# EAGLE design Sketch_1 (EAGLE 9.4.2)
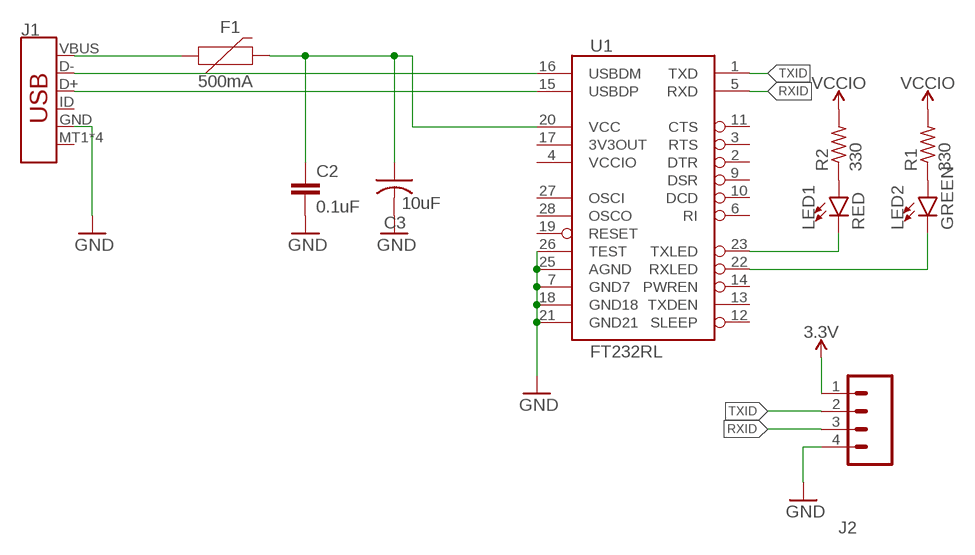
[diagram p0: schematic, sheet 1]

## Parts
C2  0.1uF  C-EUC1206K  [C1206K]
C3  10uF  C-USC1206K  [C1206K]
F1  500mA  PPTC_6V500MA  [0805]
J1  USB_MICRO-B_SMT  [USB-MICROB]
J2  M04  [04P]
LED1  RED  LED-RED1206  [LED-1206]
LED2  GREEN  LED-GREEN1206  [LED-1206]
R1  330  R-US_R1206  [R1206]
R2  330  R-US_R1206  [R1206]
U1  FT232RL  FT232RLSSOP  [SSOP28DB]

## Nets
GND: C2.2 C3.2 J1.GND J2.4 U1.7(GND7) U1.18(GND18) U1.21(GND21) U1.25(AGND) U1.26(TEST)
N$1: F1.1 J1.VBUS
N$2: C2.1 C3.1 F1.2 U1.20(VCC)
N$3: J1.D- U1.16(USBDM)
N$4: J1.D+ U1.15(USBDP)
N$5: LED2.A R1.1
N$6: LED1.A R2.1
N$7: LED1.C U1.23(TXLED)
N$8: LED2.C U1.22(RXLED)
RXID: J2.3 U1.5(RXD)
TXID: J2.2 U1.1(TXD)
VCC: J2.1 ; supply symbol labelled 3.3V
VCCIO: R1.2 R2.2
Unconnected: J1.ID J1.MT1(SHIELD) J1.MT2(SHIELD) J1.P$1(SHIELD) J1.P$2(SHIELD) U1.2(DTR) U1.3(RTS) U1.6(RI) U1.9(DSR) U1.10(DCD) U1.11(CTS) U1.12(SLEEP) U1.13(TXDEN) U1.14(PWREN) U1.17(3V3OUT) U1.19(RESET) U1.27(OSCI) U1.28(OSCO)

## Power pins joined to a net without a drawn wire
VCCIO: U1.4(VCCIO)

## Library data of the parts
C2 = rcl:C-EU: CAPACITOR, European symbol; SPICEPREFIX: C
C3 = rcl:C-US: CAPACITOR, American symbol; SPICEPREFIX: C
F1 = SparkFun-Fuses:PPTC: Resettable Fuse PPTC Resettable Fuse. Really a sort of resistor with a polymeric positive temperature coefficient whose resistance increases dramatically with an increase in temperature. When heated by the power passing through the resistance rises causing the current to be limited, protecting the circuit. This is achieved by the transition of the polymer from a crystalline to an amorphous state where the conductive carbon separates breaking the conductive pathways found in the cool crystalline structure. When a PPTC cools back down it resumes conducting letting the circuit turn back on. SparkFun Products: SparkFun RedBoard - Programmed with Arduino <https://www.sparkfun.com/products/12757> Pro Micro - 5V/16MHz <https://www.sparkfun.com/products/12640> Arduino Pro 328 - 5V/16MHz <https://www.sparkfun.com/products/10915> MP3 Trigger <https://www.sparkfun.com/products/13720>; PROD_ID: 13945; VALUE: 6V 0.5A
J1 = SparkFun-Connectors:USB_MICRO-B: USB Type Micro-B Connector Male/female and PTH/SMT variants SparkFun Products: SparkFun microB USB Breakout <https://www.sparkfun.com/products/12035> SparkFun USB microB Plug Breakout <https://www.sparkfun.com/products/10031> SparkFun ESP8266 Thing <https://www.sparkfun.com/products/13231>; PROD_ID: CONN-09505; SF_ID: PRT-08533
J2 = con-amp-quick:M04: AMP QUICK CONNECTOR; OC_FARNELL: unknown; OC_NEWARK: unknown
LED1 = SparkFun-LED:LED-RED: Red SMD LED Used in manufacturing of most products at SparkFun Packages: 0603 - SMD 0603 package [Product Link] <http://docs.avagotech.com/docs/AV02-0551EN> 0603 SMART - SMD 0603 SMART package ( more efficient and expensive)[Product Link] <http://www.osram-os.com/Graphics/XPic2/00077099_0.pdf> 1206 - SMD1206 package [Product Link] <https://www.sparkfun.com/datasheets/DevTools/LilyPad/Q150OVS4.pdff> SparkFun Products: Pro Mini 328 -5V <https://www.sparkfun.com/products/821> RedBoard <https://www.sparkfun.com/products/12757> IOIO-OTG <https://www.sparkfun.com/products/13613>; PROD_ID: DIO-09912
LED2 = SparkFun-LED:LED-GREEN: Green SMD LED Used in manufacturing of various products at SparkFun Packages: 0603 - SMD 0603 package [Product Link] <http://www.futureelectronics.com/en/technologies/semiconductors/optoelectronics/leds/Pages/9894312-LTST-C190GKT.aspx?CrossPart=HSMG-C190&IM=0> LilyPad 1206 - SMD1206 LilyPad package [Product Link] <http://www.futureelectronics.com/en/Technologies/Product.aspx?ProductID=IN150NGHARVATEKCORPORATION2049943&IM=0> 1206 - SMD1206 package [Product Link] <http://www.futureelectronics.com/en/technologies/semiconductors/optoelectronics/leds/Pages/8315665-LTST-C150KGKT.aspx?IM=0> 1206 Bottom Mount -SMD 1206 Bottom Mount [Product Link] <http://www.digikey.com/product-detail/en/lite-on-inc/LTST-C230KGKT/160-1456-1-ND/386854> SparkFun Products: Pro Mini 328 -5V <https://www.sparkfun.com/products/821> RedBoard <https://www.sparkfun.com/products/12757> MP3 Trigger <https://www.sparkfun.com/products/13720> Makey Makey <https://www.sparkfun.com/products/11076>; PROD_ID: DIO-00862
R1 R2 = rcl:R-US_: RESISTOR, American symbol; SPICEPREFIX: R
U1 = SparkFun-IC-Comms:FT232RL: FT232RL USB UART FT232RL 4th Generation USB UART (USB <-> Serial) Controller. Datasheet <http://www.sparkfun.com/datasheets/IC/FT232R_v104.pdf> SparkFun Products Component <https://www.sparkfun.com/products/650> (COM-00650) SparkFun RedBot Mainboard <https://www.sparkfun.com/products/12097> (ROB-12097) SparkFun FTDI Basic Breakout - 5V <https://www.sparkfun.com/products/9716> (DEV-09716) SparkFun FTDI Basic Breakout - 3.3V <https://www.sparkfun.com/products/9873> (DEV-09873) Bus Pirate - v3.6a <https://www.sparkfun.com/products/12942> (TOL-12942) SparkFun USB to Serial Breakout - FT232RL <https://www.sparkfun.com/products/12731> (BOB-12731) SparkFun PicoBoard <https://www.sparkfun.com/products/11888> (WIG-11888) SparkFun RFID USB Reader <https://www.sparkfun.com/products/9963> (SEN-09963) LilyPad FTDI Basic Breakout - 5V <https://www.sparkfun.com/products/10275> (DEV-10275) SparkFun Stepoko <https://www.sparkfun.com/products/13899> (ROB-13899); PROD_ID: IC-00870

## Board
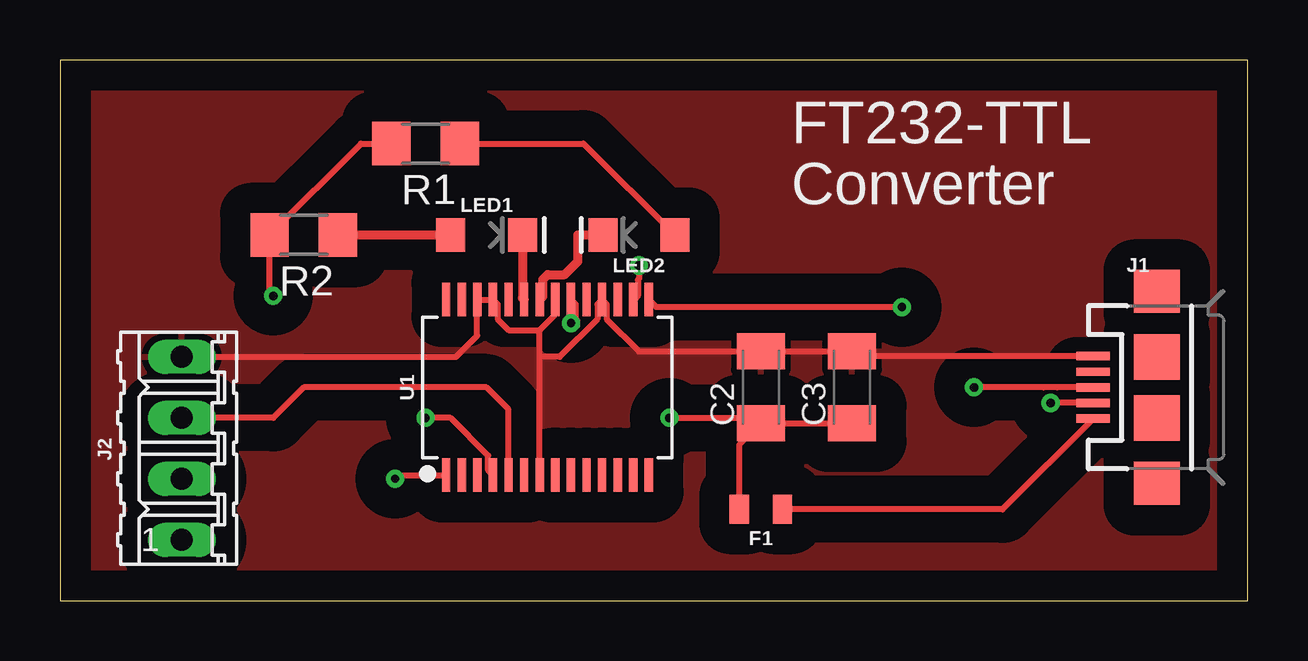
[diagram p1: board, top side]
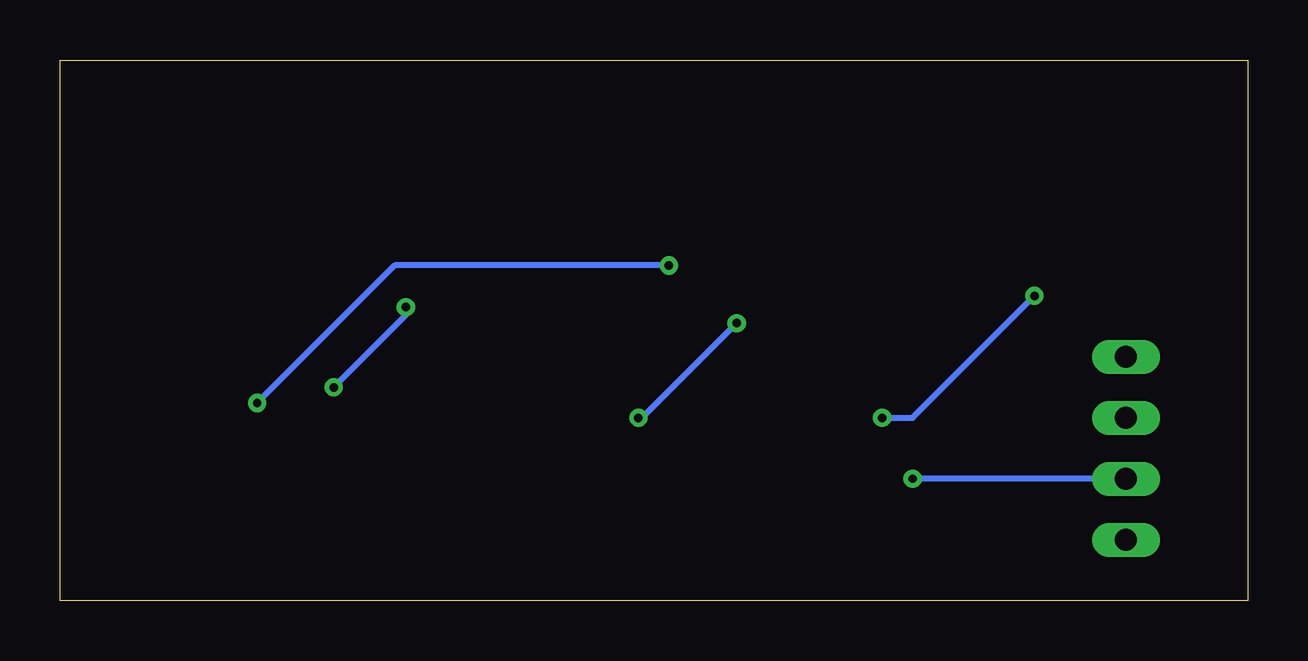
[diagram p2: board, bottom side, seen from below]

Size 49.51 x 22.53 mm. Coordinates in mm from the lower left corner, seen from the top.
Outline: 0,0 49.51,0 49.51,22.53 0,22.53 0,0
Copper layers (1*16): Top 0.035mm / dielectric 1.5mm / Bottom 0.035mm
Design rules "default": minimum track width 6mil, minimum drill 0.35mm, track to track 6mil, track to pad 6mil, pad to pad 6mil, via to via 6mil, smd to smd 6mil, copper to edge 40mil, drill to drill 6mil, minimum pad ring 10mil, minimum via ring 8mil, stop-mask expansion 4mil, vias tented up to drill 0mil, thermal gap 10mil

### Footprints (pad centres in the part's own frame; a part is rotated, then mirrored left to right if it is on the bottom)
C1206K = smd 1.5 x 2: 1 -1.5,0; 2 1.5,0
0805 = smd 0.8 x 1.2: 1 -0.9,0; 2 0.9,0
USB-MICROB = smd 1.4 x 0.35: D+ -2.65,0; D- -2.65,-0.65; GND -2.65,1.3; ID -2.65,0.65; VBUS -2.65,-1.3 | smd 1.9 x 1.8: MT1 0,-4; MT2 0,4 | smd 1.9 x 1.9: P$1 0,-1.27; P$2 0,1.27
04P = drill 0.914 long: 1 -3.81,0; 2 -1.27,0; 3 1.27,0; 4 3.81,0
LED-1206 = smd 1.2 x 1.4: A -1.5,0; C 1.5,0
R1206 = smd 1.6 x 1.803: 1 -1.422,0; 2 1.422,0
SSOP28DB = smd 0.348 x 1.397: 1 -4.225,-3.656; 2 -3.575,-3.656; 3 -2.925,-3.656; 4 -2.275,-3.656; 5 -1.625,-3.656; 6 -0.975,-3.656; 7 -0.325,-3.656; 8 0.325,-3.656; 9 0.975,-3.656; 10 1.625,-3.656; 11 2.275,-3.656; 12 2.925,-3.656; 13 3.575,-3.656; 14 4.225,-3.656; 15 4.225,3.656; 16 3.575,3.656; 17 2.925,3.656; 18 2.275,3.656; 19 1.625,3.656; 20 0.975,3.656; 21 0.325,3.656; 22 -0.325,3.656; 23 -0.975,3.656; 24 -1.625,3.656; 25 -2.275,3.656; 26 -2.925,3.656; 27 -3.575,3.656; 28 -4.225,3.656

### Placement (x,y rotation side)
C2  29.21,8.89 90 top
C3  33.02,8.89 90 top
F1  29.21,3.81 180 top
J1  45.72,8.89 0 top
J2  5.08,6.35 90 top
LED1  17.78,15.24 0 top
LED2  24.13,15.24 180 top
R1  15.24,19.05 180 top
R2  10.16,15.24 180 top
U1  20.32,8.89 0 top

### Tracks (layer width: path | path; a pad name or v marks a point on that pad's centre or on a via)
GND
  Top 0.254: U1.21 20.6,12.5 20.6,11.88 20,11.28 | U1.7 20,10.16 | 20,10.16 20,11.28 | J2.4 16.51,10.16 17.39,11.04 U1.26 U1.25 18.24,12.35 18.24,11.73 18.7,11.28 20,11.28 | 20,10.16 20.83,10.16 22.4,11.73 22.4,12.35 U1.18 22.79,12.35 22.79,11.73 24.13,10.39 C2.2 C3.2 33.22,10.19 J1.GND
  pour Top (isolate 1.27): 0,22.86 0,0 49.53,0 49.53,22.86
N$1
  Top 0.254: J1.VBUS 39.29,3.81 F1.1
N$2  (via drill 0.35)
  Top 0.254: U1.20 21.49,12.35 21.49,11.73 21.56,11.67 21.56,11.46 21.4,11.46 v21.3,11.57 | v25.4,7.62 28.98,7.62 C2.1 | C2.1 28.31,6.49 F1.2 | C2.1 C3.1
  Bottom 0.254: v21.3,11.57 25.25,7.62 v25.4,7.62
N$3  (via drill 0.35)
  Top 0.254: J1.D- v41.29,8.24 | v24.13,13.97 24.13,13.4 24.09,13.36 24.09,12.7 23.94,12.55 U1.16
  Bottom 0.254: v24.13,13.97 35.56,13.97 v41.29,8.24
N$4  (via drill 0.35)
  Top 0.254: v35.09,12.24 24.86,12.24 U1.15 | J1.D+ 41.57,8.89 41.56,8.9 41.02,8.9 41.01,8.89 v38.1,8.89
  Bottom 0.254: v38.1,8.89 35.09,11.89 v35.09,12.24
N$5
  Top 0.254: R1.1 21.82,19.05 LED2.A
N$6
  Top 0.381: R2.1 LED1.A
N$7
  Top 0.381: LED1.C 19.28,12.61 U1.23
N$8
  Top 0.381: U1.22 20.13,12.68 20.13,13.39 20.33,13.59 21.04,13.59 21.59,14.14 21.59,15.24 LED2.C
RXID
  Top 0.254: U1.5 18.7,7.97 17.78,8.89 10.16,8.89 8.89,7.62 J2.3
TXID  (via drill 0.35)
  Top 0.254: v13.97,5.08 14.12,5.23 U1.1
  Bottom 0.254: J2.2 v13.97,5.08
VCCIO  (via drill 0.35)
  Top 0.254: R1.2 12.55,19.05 R2.2 8.74,12.85 v8.89,12.7 | U1.4 17.85,5.43 17.85,6.05 16.28,7.62 v15.24,7.62
  Bottom 0.254: v15.24,7.62 13.97,7.62 v8.89,12.7

### Text on the board
tPlace: FT232-TTL | Converter